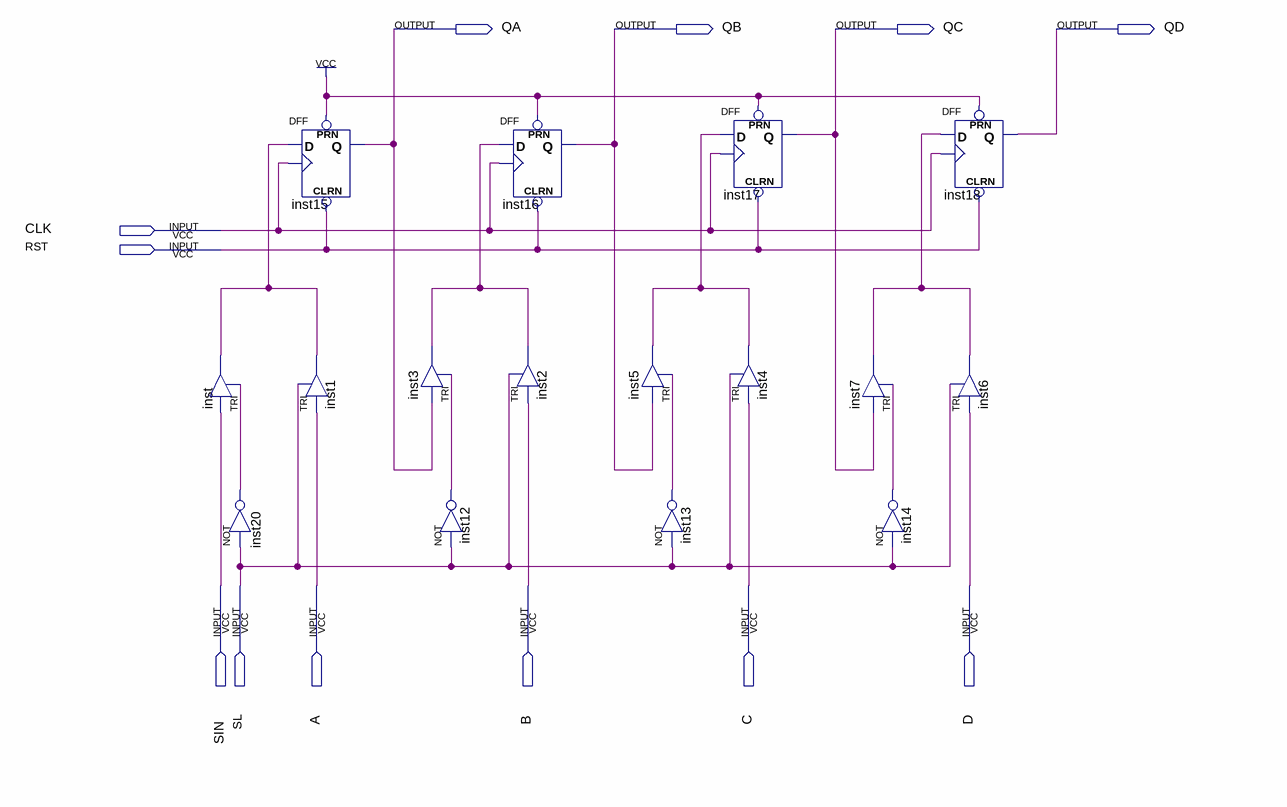
[diagram p0: schematic sheet]
// Quartus schematic Ex8Tri.bdf as structural Verilog: 16 symbols, 12 pins
module Ex8Tri (
  input  CLK,
  input  RST,
  input  SIN,
  input  SL,
  input  A,
  input  B,
  input  C,
  input  D,
  output QA,
  output QB,
  output QC,
  output QD
);

  wire inst3_out, inst5_out, inst7_out, inst12_out, inst13_out, inst14_out, inst20_out, inst_out;

  TRI inst (.IN(SIN), .OE(inst20_out), .OUT(inst_out));
  not inst20 (inst20_out, SL);
  DFF inst15 (.CLRN(RST), .CLK(CLK), .D(inst_out), .PRN(1'b1), .Q(QA));
  TRI inst1 (.IN(A), .OE(SL), .OUT(inst_out));
  TRI inst3 (.IN(QA), .OE(inst12_out), .OUT(inst3_out));
  not inst12 (inst12_out, SL);
  DFF inst16 (.CLRN(RST), .CLK(CLK), .D(inst3_out), .PRN(1'b1), .Q(QB));
  TRI inst2 (.IN(B), .OE(SL), .OUT(inst3_out));
  TRI inst5 (.IN(QB), .OE(inst13_out), .OUT(inst5_out));
  not inst13 (inst13_out, SL);
  DFF inst17 (.CLRN(RST), .CLK(CLK), .D(inst5_out), .PRN(1'b1), .Q(QC));
  TRI inst4 (.IN(C), .OE(SL), .OUT(inst5_out));
  TRI inst7 (.IN(QC), .OE(inst14_out), .OUT(inst7_out));
  not inst14 (inst14_out, SL);
  DFF inst18 (.CLRN(RST), .CLK(CLK), .D(inst7_out), .PRN(1'b1), .Q(QD));
  TRI inst6 (.IN(D), .OE(SL), .OUT(inst7_out));
endmodule
